# EAGLE design WIFIAMFMRadioShield (EAGLE 5.11)
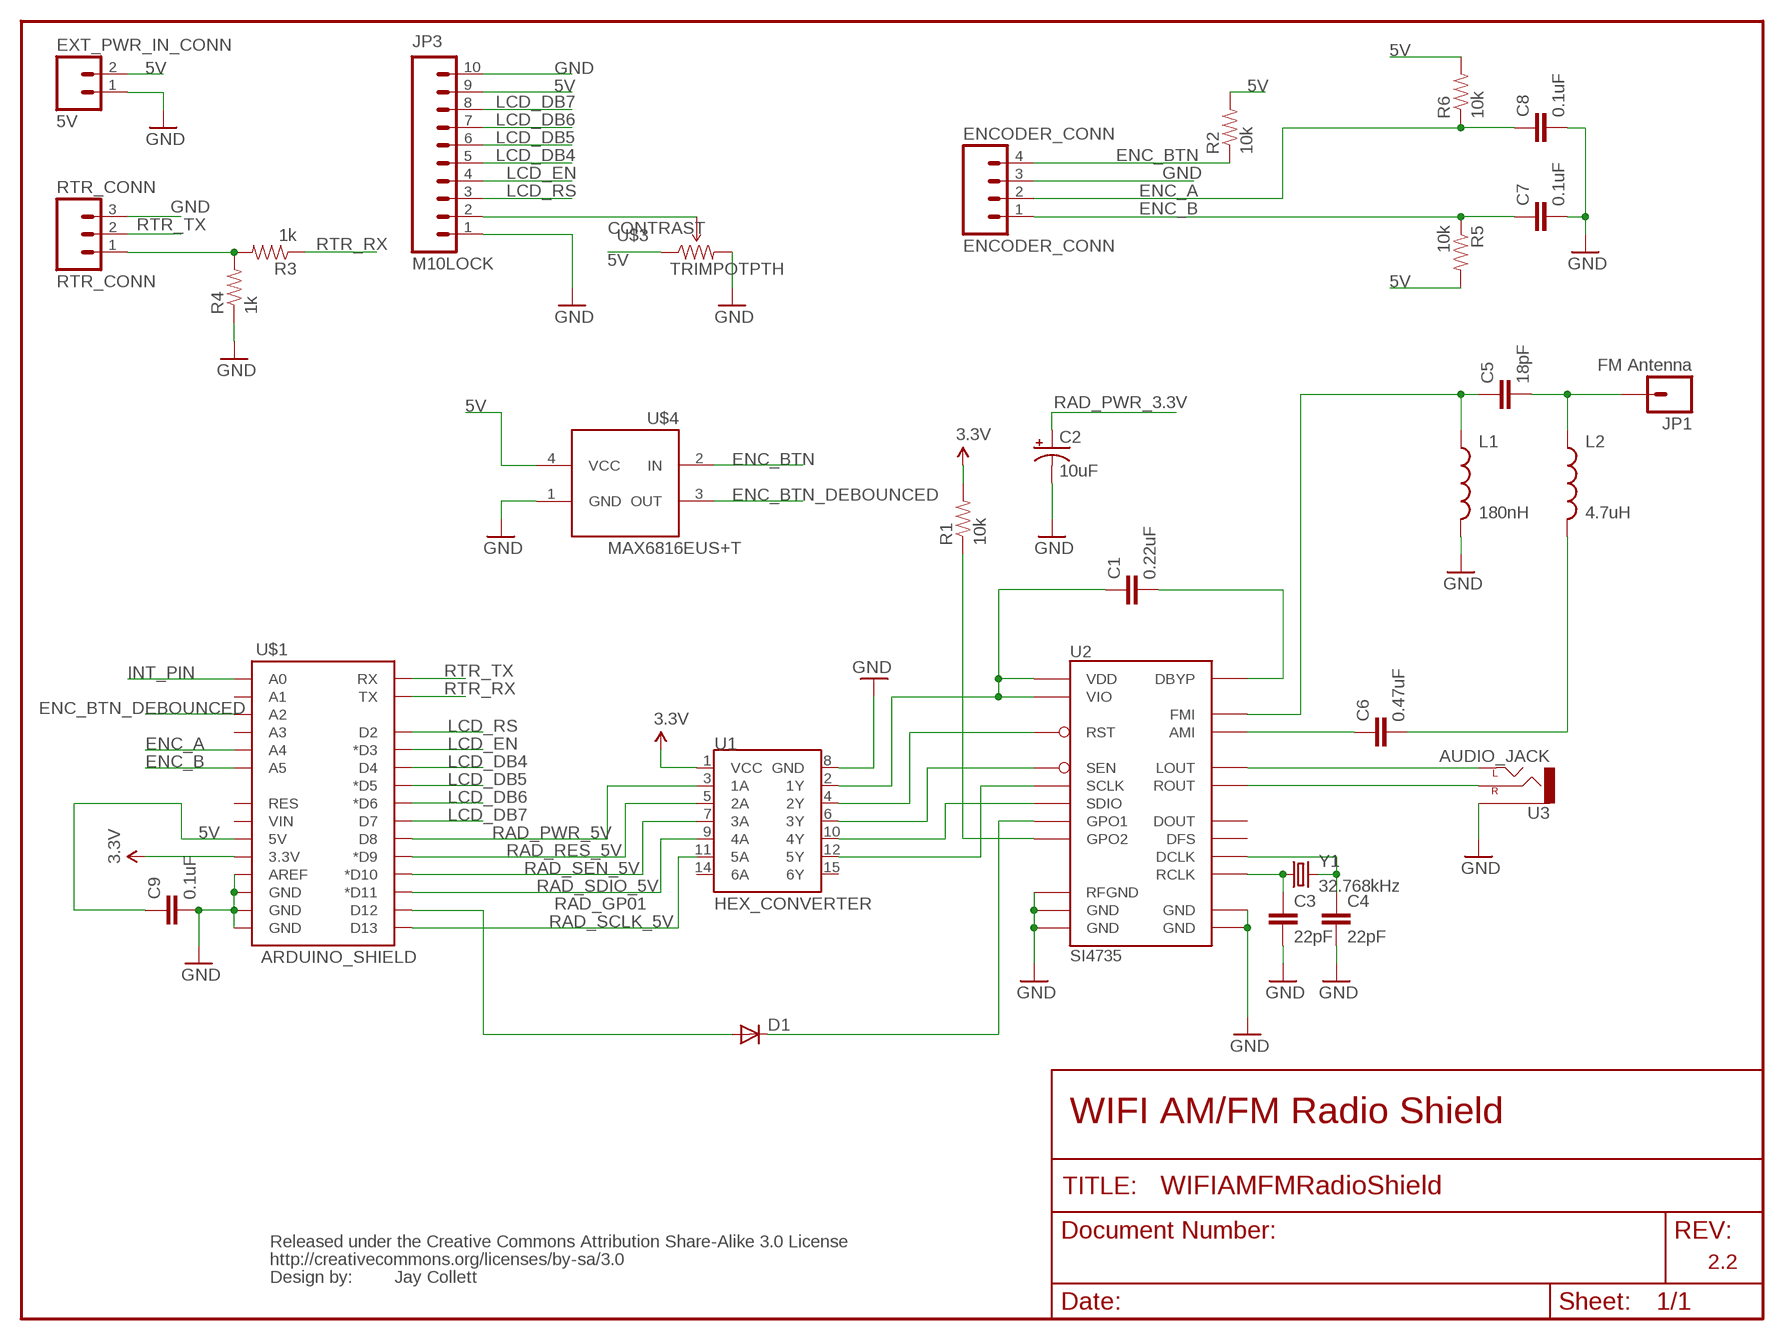
[diagram p0: schematic, sheet 1]

## Parts
C1  0.22uF  CAP0805  [0805]
C2  10uF  CAP_POL3528  [EIA3528]
C3  22pF  CAP0805  [0805]
C4  22pF  CAP0805  [0805]
C5  18pF  CAP0805  [0805]
C6  0.47uF  CAP0805  [0805]
C7  0.1uF  CAP0603-CAP  [0603-CAP]
C8  0.1uF  CAP0603-CAP  [0603-CAP]
C9  0.1uF  CAP0603-CAP  [0603-CAP]
D1  DIODESMA  [SMA-DIODE]
ENCODER_CONN  ENCODER_CONN  M04PTH  [1X04]
EXT_PWR_IN_CONN  5V  M02LOCK  [1X02_LOCK]
JP1  FM Antenna  M01OFFSET  [1X01_OFFSET]
JP3  M10LOCK  [1X10_LOCK]
L1  180nH  INDUCTOR1210  [1210]
L2  4.7uH  INDUCTOR1210  [1210]
R1  10k  RESISTOR0805-RES  [0805]
R2  10k  RESISTOR0805-RES  [0805]
R3  1k  RESISTOR0805-RES  [0805]
R4  1k  RESISTOR0805-RES  [0805]
R5  10k  RESISTOR0805-RES  [0805]
R6  10k  RESISTOR0805-RES  [0805]
RTR_CONN  RTR_CONN  M03PTH  [1X03]
U1  HEX_CONVERTER  [SO016]
U2  SI4735  [SSOP24_NARROW]
U3  AUDIO_JACK  AUDIO-JACKSMD2  [AUDIO-JACK-3.5MM-SMD]
U$1  ARDUINO_SHIELD  ARDUINO_SHIELDNOLABELS  [DUEMILANOVE_SHIELD_NOLABELS]
U$2  CREATIVE_COMMONS  [CREATIVE_COMMONS]
U$3  TRIMPOTPTH  [TRIM_POT_PTH]
U$4  MAX6816EUS+T  [SOT-143-4]
Y1  32.768kHz  CRYSTAL32-SMD  [CRYSTAL-32KHZ-SMD]

## Nets
5V: C9.1 EXT_PWR_IN_CONN.2 JP3.9 R2.2 R5.2 R6.2 U$1.5V U$3.1(CCW) U$4.4(VCC)
CONTRAST: JP3.2 U$3.2(WIPER)
ENC_A: C8.1 ENCODER_CONN.2 R6.1 U$1.A4
ENC_B: C7.1 ENCODER_CONN.1 R5.1 U$1.A5
ENC_BTN: ENCODER_CONN.4 R2.1 U$4.2(IN)
ENC_BTN_DEBOUNCED: U$1.A2 U$4.3(OUT)
GND: C2.C(-) C3.2 C4.2 C7.2 C8.2 C9.2 ENCODER_CONN.3 EXT_PWR_IN_CONN.1 JP3.1 JP3.10 L1.2 R4.1 RTR_CONN.3 U1.8(GND) U2.9(RFGND) U2.10(GND) U2.11(GND) U2.13(GND) U2.14(GND) U3.SLEEVE U$1.AREF U$1.GND@0(GND) U$1.GND@1(GND) U$1.GND@2(GND) U$3.3(CW) U$4.1(GND)
INT_PIN: R1.1 U2.4(GPO2) U$1.A0
LCD_DB4: JP3.5 U$1.D4
LCD_DB5: JP3.6 U$1.D5(*D5)
LCD_DB6: JP3.7 U$1.D6(*D6)
LCD_DB7: JP3.8 U$1.D7
LCD_EN: JP3.4 U$1.D3(*D3)
LCD_RS: JP3.3 U$1.D2
N$1: R3.2 R4.2 RTR_CONN.1
N$2: U2.24(LOUT) U3.TIP(LEFT)
N$3: U1.4(2Y) U2.15(RST)
N$4: U1.6(3Y) U2.16(SEN)
N$5: U1.10(4Y) U2.18(SDIO)
N$6: U1.12(5Y) U2.17(SCLK)
N$7: U2.23(ROUT) U3.RING(RIGHT)
N$8: D1.A U$1.D12
N$9: C1.2 U2.22(DBYP)
N$10: C3.1 U2.19(RCLK) Y1.X1
N$11: C4.1 U2.3(DCLK) Y1.X2
N$12: C5.1 L1.1 U2.8(FMI)
N$13: C5.2 JP1.1 L2.1
N$14: C6.2 L2.2
N$15: C6.1 U2.12(AMI)
RAD_GP01: D1.C U2.5(GPO1)
RAD_PWR_3.3V: C1.1 C2.A(+) U1.2(1Y) U2.20(VIO) U2.21(VDD)
RAD_PWR_5V: U1.3(1A) U$1.D8
RAD_RES_5V: U1.5(2A) U$1.D9(*D9)
RAD_SCLK_5V: U1.11(5A) U$1.D13
RAD_SDIO_5V: U1.9(4A) U$1.D11(*D11)
RAD_SEN_5V: U1.7(3A) U$1.D10(*D10)
RTR_RX: R3.1 U$1.TX
RTR_TX: RTR_CONN.2 U$1.RX
VCC: R1.2 U1.1(VCC) U$1.3.3V ; supply symbol labelled 3.3V
Unconnected: U1.14(6A) U1.15(6Y) U2.1(DOUT) U2.2(DFS) U$1.A1 U$1.A3 U$1.RES U$1.VIN

## Notes on the sheet
- WIFI AM/FM Radio Shield
- 2.2
- Jay Collett

## Library data of the parts
C1 C3-C9 = SparkFun:CAP: Capacitor Standard 0603 ceramic capacitor, and 0.1" leaded capacitor.
C2 = SparkFun:CAP_POL: Capacitor Polarized These are standard SMD and PTH capacitors. Normally 10uF, 47uF, and 100uF in electrolytic and tantalum varieties. Always verify the external diameter of the through hole cap, it varies with capacity, voltage, and manufacturer. The EIA devices should be standard.
D1 = SparkFun:DIODE: Diode These are standard reverse protection diodes and small signal diodes. SMA package can handle up to about 1A. SOD-323 can handle about 200mA. What the SOD-323 package when ordering, there are some mfgs out there that are 5-pin packages.
ENCODER_CONN = SparkFun:M04: Header 4 Standard 4-pin 0.1" header. Use with straight break away headers (SKU : PRT-00116), right angle break away headers (PRT-00553), swiss pins (PRT-00743), machine pins (PRT-00117), and female headers (PRT-00115). Molex polarized connector foot print use with SKU : PRT-08231 with associated crimp pins and housings. 1MM SMD Version SKU: PRT-10208
EXT_PWR_IN_CONN = SparkFun:M02: Header 2 Standard 2-pin 0.1" header. Use with straight break away headers (SKU : PRT-00116), right angle break away headers (PRT-00553), swiss pins (PRT-00743), machine pins (PRT-00117), and female headers (PRT-00115). Molex polarized connector foot print use with SKU : PRT-08233 with associated crimp pins and housings.
JP1 = SparkFun:M01: Header 1 Standard 1-pin 0.1" header. Use with straight break away headers (SKU : PRT-00116), right angle break away headers (PRT-00553), swiss pins (PRT-00743), machine pins (PRT-00117), and female headers (PRT-00115).
JP3 = SparkFun:M10: Header 10 Standard 10-pin 0.1" header. Use with straight break away headers (SKU : PRT-00116), right angle break away headers (PRT-00553), swiss pins (PRT-00743), machine pins (PRT-00117), and female headers (PRT-00115).
L1 L2 = SparkFun:INDUCTOR: Inductors Basic Inductor/Choke - 0603 and 1206. Footprints are not proven and vary greatly between part numbers.
R1-R6 = SparkFun:RESISTOR: Resistor Basic schematic elements and footprints for 0603, 1206, and PTH resistors.
RTR_CONN = SparkFun:M03: Header 3 Standard 3-pin 0.1" header. Use with straight break away headers (SKU : PRT-00116), right angle break away headers (PRT-00553), swiss pins (PRT-00743), machine pins (PRT-00117), and female headers (PRT-00115). Molex polarized connector foot print use with SKU : PRT-08232 with associated crimp pins and housings.
U1 = SparkFun:HEX_CONVERTER
U2 = SparkFun:SI4735: Radio chip that covers FM broadcast with RDS, plus a bunch of shortwave and logwave frequencies
U3 = SparkFun:AUDIO-JACK: 3.5mm Audio Jack Simple 3.5mm common PCB mount audio jack. SKU: PRT-08032
U$1 = SparkFun:ARDUINO_SHIELD
U$2 = SparkFun:CREATIVE_COMMONS
U$3 = SparkFun:TRIMPOT
U$4 = JayCollett:MAX6816EUS+T: Maxim MAX6816 SMD debounce IC. http://datasheets.maxim-ic.com/en/ds/MAX6816-MAX6818.pdf
Y1 = SparkFun:CRYSTAL: Crystals Various standard crystals. Proven footprints. Spark Fun Electronics SKU : COM-00534

## Board
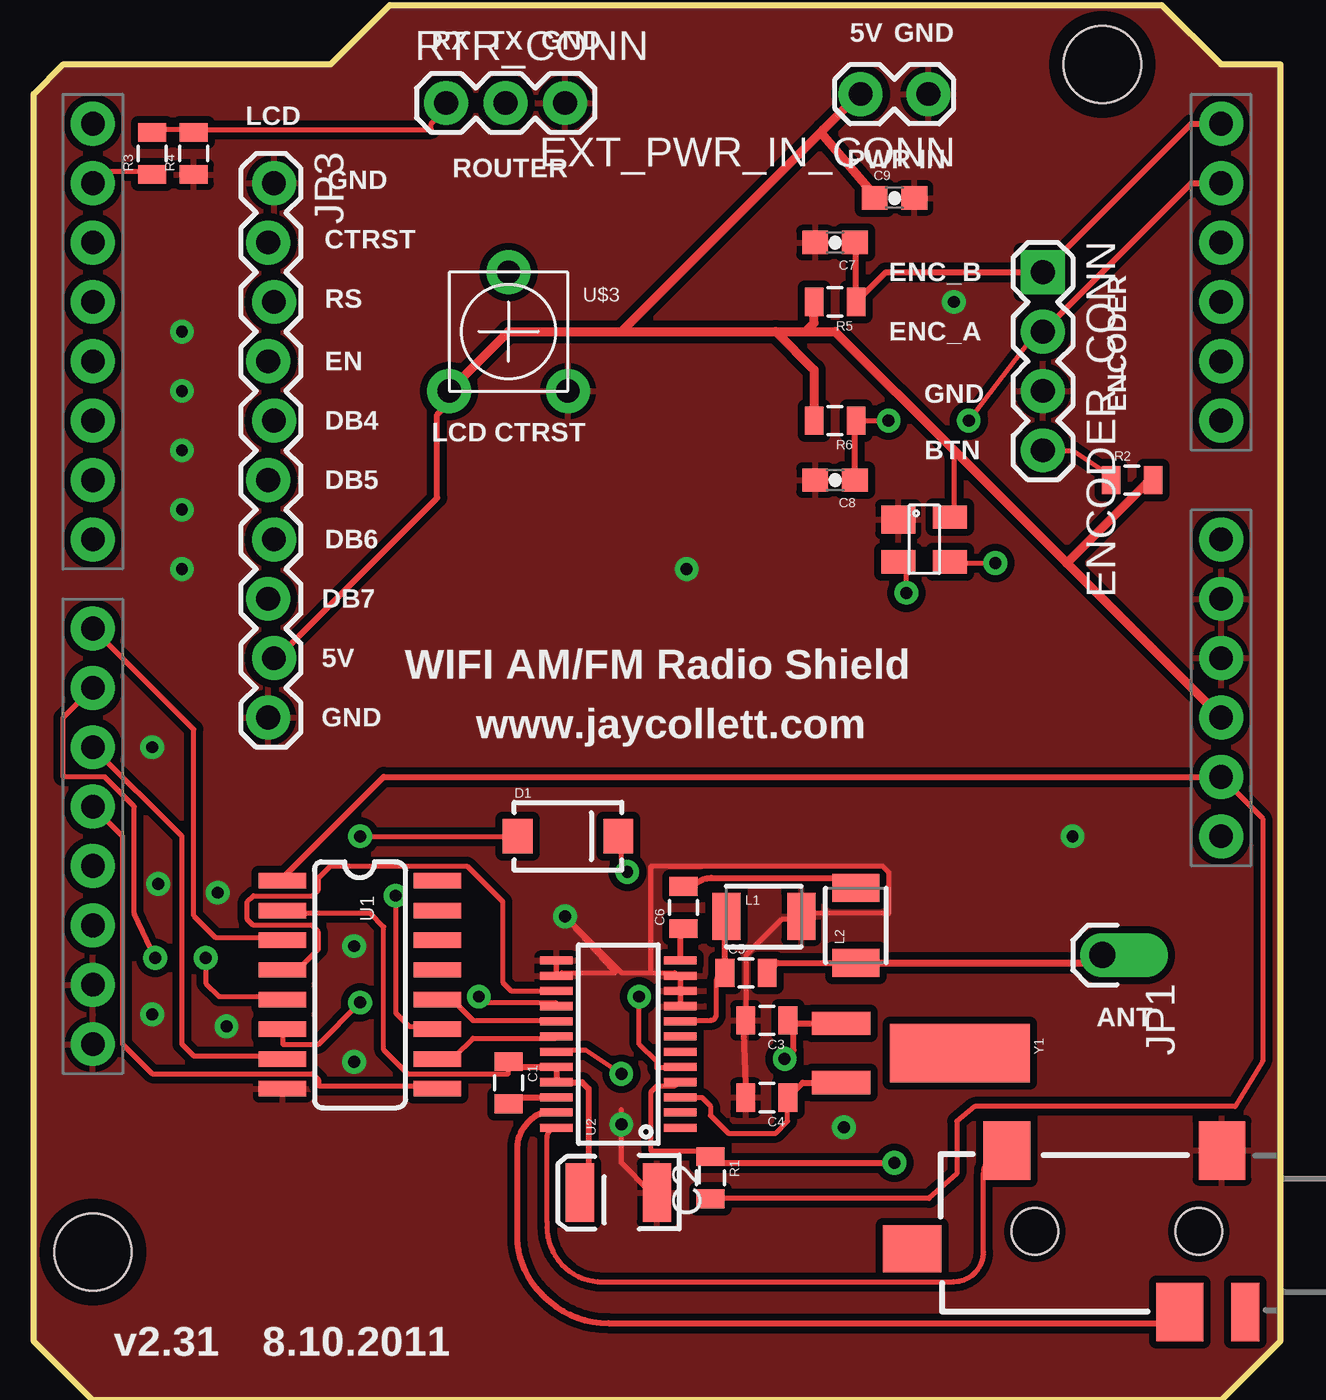
[diagram p1: board, top side]
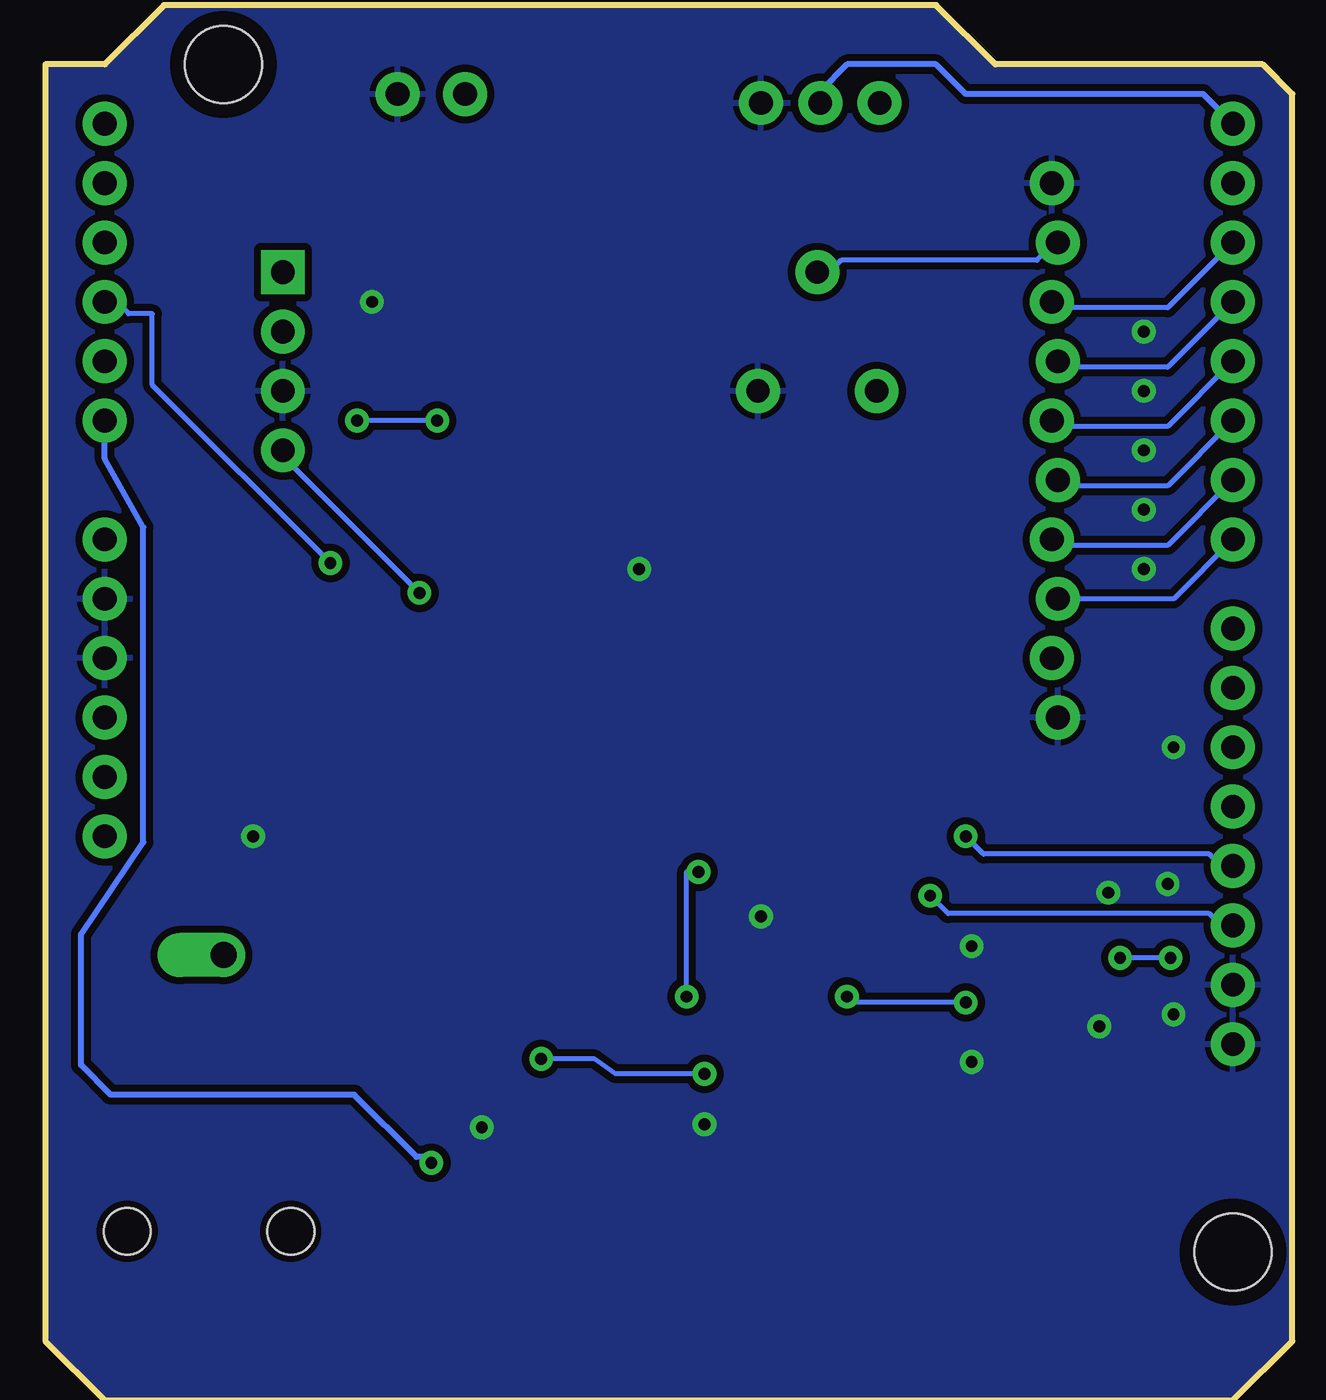
[diagram p2: board, bottom side, seen from below]

No outline drawn. Coordinates in mm, seen from the top.
Copper layers (1*16): Top 0.035mm / dielectric 1.5mm / Bottom 0.035mm
Design rules "SparkFun": minimum track width 8mil, minimum drill 20mil, track to track 8mil, track to pad 8mil, pad to pad 8mil, via to via 8mil, smd to smd 8mil, copper to edge 10mil, drill to drill 8mil, minimum pad ring 12mil, minimum via ring 10mil, stop-mask expansion 4mil, vias tented up to drill 25mil, thermal gap 10mil
Milling: 11 lines

### Footprints (pad centres in the part's own frame; a part is rotated, then mirrored left to right if it is on the bottom)
0805 = smd 0.8 x 1.2: 1 -0.9,0; 2 0.9,0
EIA3528 = smd 1.2 x 2.5: A 1.65,0; C -1.65,0
0603-CAP = smd 1.1 x 1: 1 -0.85,0; 2 0.85,0
SMA-DIODE = smd 1.27 x 1.47: A -2.15,0; C 2.15,0
1X04 = drill 1.016 pad 1.88 square: 1 0,0 | drill 1.016 pad 1.88 round: 2 2.54,0; 3 5.08,0; 4 7.62,0
1X02_LOCK = drill 1.016 pad 1.88 round: 1 -0.178,0; 2 2.718,0
1X01_OFFSET = drill 1.118 pad 1.88 offset: 1 0,0
1X10_LOCK = drill 1.016 pad 1.88 round: 1 0,0.127; 2 2.54,-0.127; 3 5.08,0.127; 4 7.62,-0.127; 5 10.16,0.127; 6 12.7,-0.127; 7 15.24,0.127; 8 17.78,-0.127; 9 20.32,0.127; 10 22.86,-0.127
1210 = smd 1.2 x 2: 1 -1.6,0; 2 1.6,0
1X03 = drill 1.016 pad 1.88 round: 1 0,0; 2 2.54,0; 3 5.08,0
SO016 = smd 0.66 x 2.032: 1 -4.445,-3.315; 2 -3.175,-3.315; 3 -1.905,-3.315; 4 -0.635,-3.315; 5 0.635,-3.315; 6 1.905,-3.315; 7 3.175,-3.315; 8 4.445,-3.315; 9 4.445,3.315; 10 3.175,3.315; 11 1.905,3.315; 12 0.635,3.315; 13 -0.635,3.315; 14 -1.905,3.315; 15 -3.175,3.315; 16 -4.445,3.315
SSOP24_NARROW = smd 0.348 x 1.397: 1 -3.575,-2.65; 2 -2.925,-2.65; 3 -2.275,-2.65; 4 -1.625,-2.65; 5 -0.975,-2.65; 6 -0.325,-2.65; 7 0.325,-2.65; 8 0.975,-2.65; 9 1.625,-2.65; 10 2.275,-2.65; 11 2.925,-2.65; 12 3.575,-2.65; 13 3.575,2.65; 14 2.925,2.65; 15 2.275,2.65; 16 1.625,2.65; 17 0.975,2.65; 18 0.325,2.65; 19 -0.325,2.65; 20 -0.975,2.65; 21 -1.625,2.65; 22 -2.275,2.65; 23 -2.925,2.65; 24 -3.575,2.65
AUDIO-JACK-3.5MM-SMD = smd 2 x 2.5: RING 4.3,3.45; SLEEVE 2.5,-3.45; TIP 11.7,-3.45 | smd 1.2 x 2.5: RSH 1.5,3.45 | smd 2.5 x 2: TSH 15.75,0.75 | hole 2: 3.5,0; 10.5,0
DUEMILANOVE_SHIELD_NOLABELS = drill 1.016 pad 1.88 round: 3.3V 50.8,26.67; 5V 50.8,29.21; A0 50.8,41.91; A1 50.8,44.45; A2 50.8,46.99; A3 50.8,49.53; A4 50.8,52.07; A5 50.8,54.61; AREF 2.54,15.24; D2 2.54,49.53; D3 2.54,46.99; D4 2.54,44.45; D5 2.54,41.91; D6 2.54,39.37; D7 2.54,36.83; D8 2.54,33.02; D9 2.54,30.48; D10 2.54,27.94; D11 2.54,25.4; D12 2.54,22.86; D13 2.54,20.32; GND@0 50.8,31.75; GND@1 50.8,34.29; GND@2 2.54,17.78; RES 50.8,24.13; RX 2.54,54.61; TX 2.54,52.07; VIN 50.8,36.83 | hole 3.302: 45.72,57.15; 2.54,6.35
TRIM_POT_PTH = drill 1 pad 1.88 round: 1 -2.54,-2.54; 2 0,2.54; 3 2.54,-2.54
SOT-143-4 = smd 1.19 x 1.45: 1 -0.855,-1.105 | smd 1 x 1.45: 2 0.955,-1.105; 3 0.955,1.105; 4 -0.955,1.105
CRYSTAL-32KHZ-SMD = smd 2.5 x 6: SHEILD 0,5.08 | smd 1 x 2.5: X1 -1.27,0; X2 1.27,0

### Placement (x,y rotation side)
C1  20.32,13.59 270 top
C2  25.02,8.89 180 top
C3  31.37,16.26 180 top
C4  31.37,12.95 180 top
C5  30.48,18.29 0 top
C6  27.81,21.08 90 top
C7  34.29,49.53 180 top
C8  34.29,39.37 180 top
C9  36.83,51.44 0 top
D1  22.86,24.13 0 top
ENCODER_CONN  43.18,48.26 270 top
EXT_PWR_IN_CONN  38.1,55.88 180 top
JP1  45.72,19.05 270 top
JP3  10.16,52.07 270 top
L1  31.24,20.7 0 top
L2  35.18,20.32 90 top
R1  28.96,9.53 270 top
R2  46.99,39.37 0 top
R3  5.08,53.34 90 top
R4  6.86,53.34 90 top
R5  34.29,46.99 180 top
R6  34.29,41.91 180 top
RTR_CONN  17.65,55.5 0 top
U1  13.97,17.78 270 top
U2  25.02,15.24 90 top
U3  53.34,7.24 180 top
U$1  0,0 0 top
U$2  0,0 0 top
U$3  20.32,45.72 0 top
U$4  38.1,36.83 270 top
Y1  34.54,14.86 270 top

### Tracks (layer width: path | path; a pad name or v marks a point on that pad's centre or on a via)
5V
  Top 0.203: 47.75,39.37 R2.2 | 33.78,54.36 33.78,54.1 | 36.07,51.44 C9.1 | U$4.4 39.37,37.85 39.37,40.39 39.5,40.51
  Top 0.254: U$3.1 17.78,42.67 17.27,42.16 17.27,38.61 10.41,31.75 JP3.9
  Top 0.381: 25.15,45.72 33.78,54.36 35.31,55.88 EXT_PWR_IN_CONN.2 | U$3.1 20.32,45.72 25.15,45.72 | 44.2,35.81 39.5,40.51 34.29,45.72 33.02,45.72 | 44.2,35.81 U$1.5V | 25.15,45.72 31.75,45.72 | 31.75,45.72 33.02,45.72 | R5.2 33.39,46.09 33.02,45.72 | R6.2 33.39,44.08 31.75,45.72 | 44.2,35.81 47.75,39.37 | 33.78,54.1 36.07,51.44
CONTRAST
  Bottom 0.203: U$3.2 19.81,48.26 19.3,48.77 10.92,48.77 10.16,49.53 JP3.2
ENC_A  (via drill 0.51)
  Top 0.203: 35.14,41.86 R6.1 v36.58,41.91 | v40.01,41.91 42.93,45.72 ENCODER_CONN.2
  Top 0.254: U$1.A4 49.53,52.07 ENCODER_CONN.2 | C8.1 35.14,41.86
  Bottom 0.203: v36.58,41.91 v40.01,41.91
ENC_B
  Top 0.254: U$1.A5 49.53,54.61 ENCODER_CONN.1 36.46,48.26 R5.1 35.19,49.48 C7.1
ENC_BTN  (via drill 0.51)
  Top 0.203: ENCODER_CONN.4 44.45,40.64 45.97,39.62 45.97,39.37 R2.1 | v37.34,34.54 37.34,35.56 37.08,35.81 U$4.2
  Bottom 0.203: v37.34,34.54 43.18,40.39 ENCODER_CONN.4
ENC_BTN_DEBOUNCED  (via drill 0.51)
  Top 0.203: v41.15,35.81 39.37,35.81 U$4.3
  Bottom 0.203: v41.15,35.81 48.77,43.43 48.77,46.48 49.78,46.48 50.29,46.99 U$1.A2
GND  (via drill 0.51)
  Top 0.203: C3.2 30.48,16.51 30.48,19.05 32,20.57 32.77,20.57 L1.2 33.02,20.83 36.58,20.83 36.58,22.61 36.32,22.86 26.42,22.86 26.42,18.29 | 27.69,17.53 27.69,17.02 U2.9 | 27.69,17.53 27.69,18.03 U2.11 27.43,18.29 26.42,18.29 | 27.69,17.53 U2.10 | U2.13 22.35,18.8 22.35,18.29 U2.14 22.61,18.29 24.89,18.29 v22.73,20.7 25.15,18.29 26.42,18.29 | U1.8 10.41,13.21 | C2.C 26.42,8.89 25.15,10.16 v25.15,11.81 25.15,12.45
  Top 0.254: C4.2 30.34,16.26 C3.2
  other vias: 13.72,19.43 34.67,11.68 44.45,24.13 5.08,16.51 8.26,16 7.87,21.72 13.72,14.48 27.94,35.56 39.37,46.99 6.35,43.18 6.35,40.64 6.35,38.1 6.35,35.56 6.35,45.72 5.08,27.94 5.33,22.1
  pour Bottom (isolate 0.305): 0,55.88 1.27,57.15 12.7,57.15 15.24,59.69 48.26,59.69 50.8,57.15 53.34,57.15 53.34,2.54 50.8,0 2.54,0 0,2.54
  pour Top (isolate 0.305): 0,55.88 1.27,57.15 12.7,57.15 15.24,59.69 48.26,59.69 50.8,57.15 53.34,57.15 53.34,2.54 50.8,0 2.54,0 0,2.54
INT_PIN  (via drill 0.51)
  Top 0.203: R1.1 28.96,10.67 26.42,10.67 26.42,13.21 26.67,13.46 27.43,13.46 U2.4
  Top 0.254: v36.83,10.16 29.22,10.16 R1.1
  Bottom 0.254: U$1.A0 50.8,40.26 49.15,37.34 49.15,23.88 51.82,19.94 51.82,14.35 50.55,13.08 40.13,13.08 37.47,10.41 37.08,10.41 v36.83,10.16
LCD_DB4
  Bottom 0.203: U$1.D4 5.33,41.66 9.91,41.66 10.16,41.91 JP3.5
LCD_DB5
  Bottom 0.203: U$1.D5 5.33,39.12 9.65,39.12 9.91,39.37 JP3.6
LCD_DB6
  Bottom 0.203: U$1.D6 5.33,36.58 9.91,36.58 10.16,36.83 JP3.7
LCD_DB7
  Bottom 0.203: U$1.D7 5.08,34.29 JP3.8
LCD_EN
  Bottom 0.203: U$1.D3 5.33,44.2 9.65,44.2 9.91,44.45 JP3.4
LCD_RS
  Bottom 0.203: U$1.D2 5.33,46.74 9.91,46.74 10.16,46.99 JP3.3
N$1
  Top 0.203: 7.37,54.36 5.33,54.36 R3.2 | 7.37,54.36 17.02,54.36 17.02,54.61 17.53,55.12 17.53,55.37 RTR_CONN.1 | R4.2 7.37,54.36
  Bottom 0.203: RTR_CONN.1 17.53,55.37
N$2
  Top 0.203: 22.35,11.68 U2.24 arc90 21.97,11.27 21.97,7.62 arc90 24.13,5.08 39.37,5.08 arc90 40.64,6.35 40.64,9.69 arc-90 U3.TIP
N$3
  Top 0.203: U2.15 22.35,17.53 20.43,17.53 20.07,17.89 20.07,21.34 18.54,22.86 12.7,22.86 12.19,22.35 12.19,21.84 11.94,21.59 9.4,21.59 9.14,21.34 9.14,20.57 9.4,20.32 11.91,20.32 12.19,20.04 12.19,19.3 11.43,18.54 10.67,18.54 U1.4
N$4  (via drill 0.51)
  Top 0.203: v19.05,17.27 19.05,17.02 22.35,17.02 U2.16 | v13.97,17.02 12.19,15.24 10.67,15.24 10.67,15.75 U1.6
  Bottom 0.203: v19.05,17.27 18.8,17.02 v13.97,17.02
N$5
  Top 0.203: U2.18 22.35,15.49 18.8,15.49 18.03,14.73 17.53,14.73 U1.10
N$6
  Top 0.203: U2.17 22.35,16.26 18.8,16.26 18.03,17.02 17.53,17.02 U1.12
N$7
  Top 0.203: 22.01,12.32 22.35,12.32 U2.23
  Top 0.254: U2.23 21.95,12.31 arc45 21.33,12.06 21.16,11.88 arc45 20.7,10.79 20.7,7.04 arc45 21.73,4.56 21.85,4.44 arc45 24.6,3.3 48.55,3.3 U3.RING
N$8  (via drill 0.51)
  Top 0.203: v13.97,24.13 D1.A
  Bottom 0.203: v13.97,24.13 13.21,23.37 3.56,23.37 3.05,22.86 U$1.D12
N$9
  Top 0.254: U2.22 20.6,12.96 C1.2
N$10  (via drill 0.51)
  Top 0.203: v25.15,13.97 23.62,14.99 22.61,14.99 U2.19 | 32.51,16.51 C3.1
  Top 0.254: 32.52,16.64 C3.1 32.4,16.13 Y1.X1 | 32.51,16.51 32.51,14.99 v32.13,14.61
  Bottom 0.203: v32.13,14.61 29.84,14.61 28.96,13.97 v25.15,13.97
N$11
  Top 0.203: U2.3 27.69,12.95 28.6,12.95 28.96,12.6 28.96,12.19 29.72,11.43 31.75,11.43 32.26,11.94 32.26,12.95 C4.1
  Top 0.254: 34.55,13.59 Y1.X2 32.9,13.59 C4.1
N$12
  Top 0.203: 29.58,18.13 C5.1 arc90 29.21,17.92 29.21,16.51 arc-90 28.96,16.26 27.71,16.26
  Top 0.254: C5.1 29.58,20.64 L1.1 | U2.8 27.71,16.26
N$13
  Top 0.254: L2.1 31.81,18.72 C5.2
  Top 0.305: L2.1 45.39,18.72 JP1.1
N$14
  Top 0.254: C6.2 28.2,21.98 28.29,22.06 arc-45 28.99,22.35 34.75,22.35 L2.2
N$15
  Top 0.254: U2.12 27.67,20.04 C6.1
RAD_GP01  (via drill 0.51)
  Top 0.203: v25.91,17.27 25.91,15.24 26.67,14.48 26.67,14.22 27.43,14.22 U2.5 | v25.4,22.61 25.15,22.86 25.15,24.13 D1.C
  Bottom 0.203: v25.91,17.27 25.91,22.61 v25.4,22.61
RAD_PWR_3.3V
  Top 0.203: U1.2 10.67,20.83 14.42,20.83 14.99,20.26 14.99,14.99 16,13.97 20.32,13.97 C1.1
  Top 0.254: C1.1 20.54,14.27 U2.20 U2.21 23.47,13.62 23.75,13.34 23.75,9.27 C2.A
RAD_PWR_5V
  Top 0.203: U$1.D8 6.86,28.7 6.86,20.73 7.77,19.81 10.41,19.81 U1.3
RAD_RES_5V  (via drill 0.51)
  Top 0.203: v7.37,18.92 7.37,17.84 7.93,17.27 10.41,17.27 U1.5 | v5.21,18.92 4.32,20.83 4.32,25.4 3.05,26.67 1.27,26.67 1.27,29.21 U$1.D9
  Bottom 0.203: v5.21,18.92 v7.37,18.92
RAD_SCLK_5V  (via drill 0.51)
  Top 0.203: v15.49,21.59 15.49,16.57 16.06,16 17.27,16 U1.11
  Bottom 0.203: v15.49,21.59 14.73,20.83 3.56,20.83 3.05,20.32 U$1.D13
RAD_SDIO_5V
  Top 0.203: U$1.D11 3.81,24.13 3.81,15.24 5.08,13.97 11.94,13.97 12.19,13.72 12.19,13.46 17.27,13.46 U1.9
RAD_SEN_5V
  Top 0.203: U$1.D10 6.35,24.13 6.35,15.24 6.86,14.73 10.41,14.73 U1.7
RTR_RX
  Top 0.203: U$1.TX 2.54,52.58 5.33,52.58 R3.1
RTR_TX
  Bottom 0.254: RTR_CONN.2 20.19,56.01 19.05,57.15 15.24,57.15 13.97,55.88 3.81,55.88 U$1.RX
VCC
  Top 0.203: U$1.3.3V 52.58,24.89 52.58,14.51 51.41,12.57 40.26,12.57 39.5,11.94 39.5,9.69 38.31,8.64 28.96,8.64 R1.2 | U1.1 10.67,22.35
  Top 0.254: 10.67,22.35 14.99,26.67 U$1.3.3V

### Text on the board
tPlace: 5V | GND | RX | TX | GND | LCD | PWR IN | GND | ROUTER | CTRST | ENC_B | RS | ENC_A | EN | GND | DB4 | ENCODER | LCD CTRST | BTN | DB5 | DB6 | DB7 | 5V | WIFI AM/FM Radio Shield | GND | www.jaycollett.com | ANT | v2.31 | 8.10.2011